# EAGLE design ESP8266-ILI9341-V003_2 (EAGLE 7.5.0)
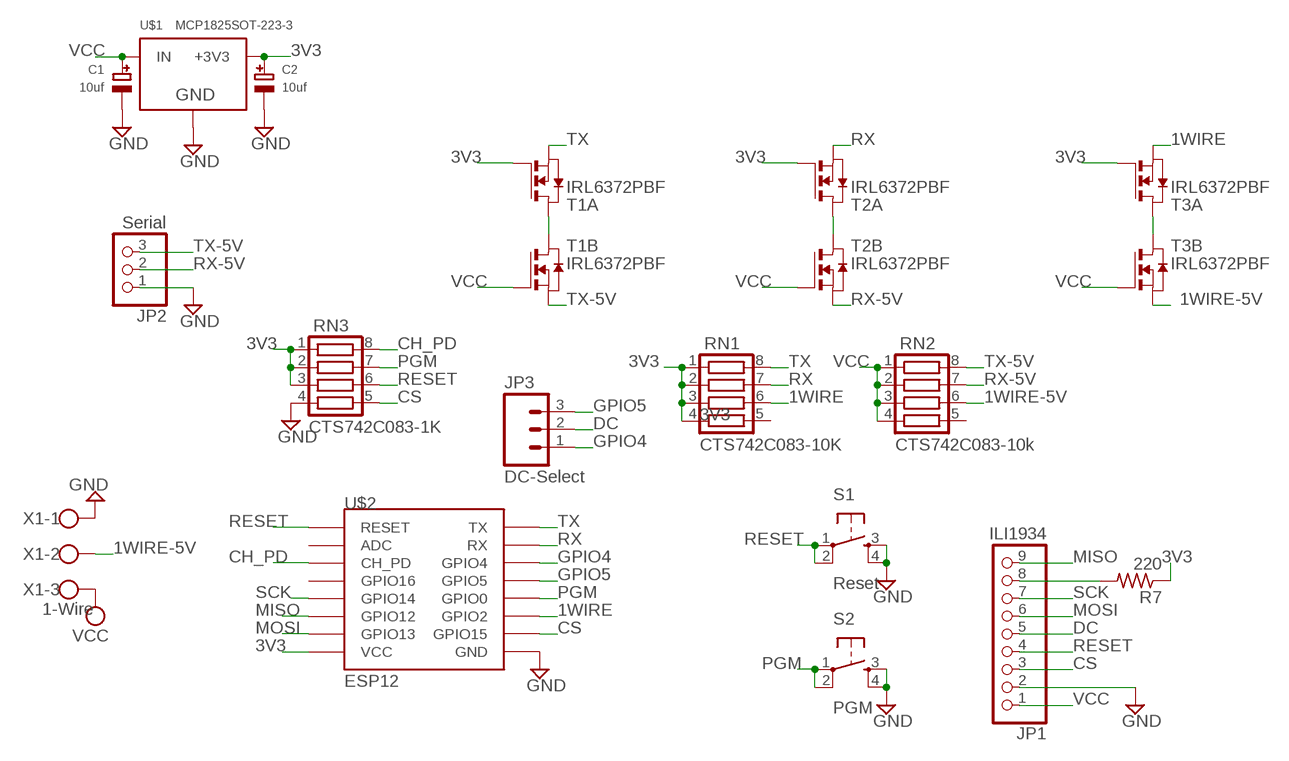
[diagram p0: schematic, sheet 1]

## Parts
C1  10uf  CAP_TANTALUMA/3216_REFLOW  [EIA3216-18/A-R]
C2  10uf  CAP_TANTALUMA/3216_REFLOW  [EIA3216-18/A-R]
JP1  ILI1934  PINHD-1X9  [1X09-BIG]
JP2  Serial  PINHD-1X3  [1X03]
JP3  DC-Select  M03PTH  [1X03]
R7  220  R-US_M1206  [M1206]
RN1  CTS742C083-10K  CTS742C083  [CTS742C083]
RN2  CTS742C083-10k  CTS742C083  [CTS742C083]
RN3  CTS742C083-1K  CTS742C083  [CTS742C083]
S1  Reset  TAC_SWITCHPTH  [TACTILE-PTH]
S2  PGM  TAC_SWITCHPTH  [TACTILE-PTH]
T1  IRL6372PBF  [SO-8-DUAL]
T2  IRL6372PBF  [SO-8-DUAL]
T3  IRL6372PBF  [SO-8-DUAL]
U$1  MCP1825SOT-223-3  [SOT-223]
U$2  ESP12  [ESP12]
X1  1-Wire  W237-103  [W237-103]

## Nets
1WIRE: RN1.6 T3.1(A:S) U$2.GPIO2
1WIRE-5V: RN2.6 T3.3(B:S) X1.2
3V3: C2.+ R7.1 RN1.1 RN1.2 RN1.3 RN1.4 RN3.1 RN3.2 RN3.3 T1.2(A:G) T2.2(A:G) T3.2(A:G) U$1.3(+3V3) U$2.VCC
CH_PD: RN3.8 U$2.CH_PD
CS: JP1.3 RN3.5 U$2.GPIO15
DC: JP1.5 JP3.2
GND: C1.- C2.- JP1.2 JP2.1 RN3.4 S1.3 S1.4 S2.3 S2.4 U$1.2(GND) U$2.GND X1.1
GPIO4: JP3.1 U$2.GPIO4
GPIO5: JP3.3 U$2.GPIO5
MISO: JP1.9 U$2.GPIO12
MOSI: JP1.6 U$2.GPIO13
N$1: T2.5_6(B:D) T2.7_8(A:D)
N$3: T3.5_6(B:D) T3.7_8(A:D)
N$7: T1.5_6(B:D) T1.7_8(A:D)
N$11: JP1.8 R7.2
PGM: RN3.7 S2.1 S2.2 U$2.GPIO0
RESET: JP1.4 RN3.6 S1.1 S1.2 U$2.RESET
RX: RN1.7 T2.1(A:S) U$2.RX
RX-5V: JP2.2 RN2.7 T2.3(B:S)
SCK: JP1.7 U$2.GPIO14
TX: RN1.8 T1.1(A:S) U$2.TX
TX-5V: JP2.3 RN2.8 T1.3(B:S)
VCC: C1.+ JP1.1 RN2.1 RN2.2 RN2.3 RN2.4 T1.4(B:G) T2.4(B:G) T3.4(B:G) U$1.1(IN) X1.3
Unconnected: RN1.5 RN2.5 U$2.ADC U$2.GPIO16

## Library data of the parts
C1 C2 = microbuilder:CAP_TANTALUM: Tantalum Capacitors Wave footprints have larger pads and are meant to be used for hand soldering. Reflow footprints are optimised for solder paste and a reflow oven. EIA3216-18/A-[R/W] - Size A / 3216-18 / 1206 footprint 4.7µF 25V 10% Tantalum Capacitor 10µF 16V 10% Tantalum Capacitor [Digikey: 495-2236-2-ND] EIA3528-21/B-[R/W] - Size B / 3528-21 47µF 10V 10% Tantalum Capactior [Digikey: 495-2216-1-ND] EIA6032-28/C-[R/W] - Size C / 6032-28 10µF 35V 20% Tantalum Capacitor [Digikey: 495-2285-1-ND] 100µF 16V 10% Tantalum Capactior [Digikey: 399-5214-1-ND]
JP1 = Adafruit:PINHD-1X9: Pin header 1x10 0.1" spacing With round pins
JP2 = Adafruit:PINHD-1X3: PIN HEADER
JP3 = SparkFun-Connectors:M03: Header 3 Standard 3-pin 0.1" header. Use with straight break away headers (SKU : PRT-00116), right angle break away headers (PRT-00553), swiss pins (PRT-00743), machine pins (PRT-00117), and female headers (PRT-00115). Molex polarized connector foot print use with SKU : PRT-08232 with associated crimp pins and housings.
R7 = rcl:R-US_: RESISTOR, American symbol
RN1-RN3 = resistor-net:CTS742C083: Chip Resistor Array 4 Single Resistor Source: http://www.ctscorp.com/components/Datasheets/CTSChipArrayDs.pdf; OC_FARNELL: unknown; OC_NEWARK: unknown
S1 S2 = SparkFun-Electromechanical:TAC_SWITCH: Momentary Switch Button commonly used for reset or general input. Spark Fun Electronics SKU : COM-00097 SMT- SWCH-08247
T1-T3 = IRL6372:IRL6372PBF: N-Channel Application-Specific MOSFETs Source: http://www.irf.com/product-info/datasheets/data/irl6372pbf.pdf
U$1 = mcp1825:MCP1825: MCP1825 3.3v LDO Linear Regulator
U$2 = esp8266modules:ESP12: ESP8266 Wifi module 12
X1 = con-wago-500:W237-103: WAGO SCREW CLAMP; MPN: 237-103; OC_FARNELL: unknown; OC_NEWARK: 18M7116

## Net classes
0 default: width 0.254 mm
1 VDD: width 0.508 mm
2 VCC: width 0.508 mm

## Board
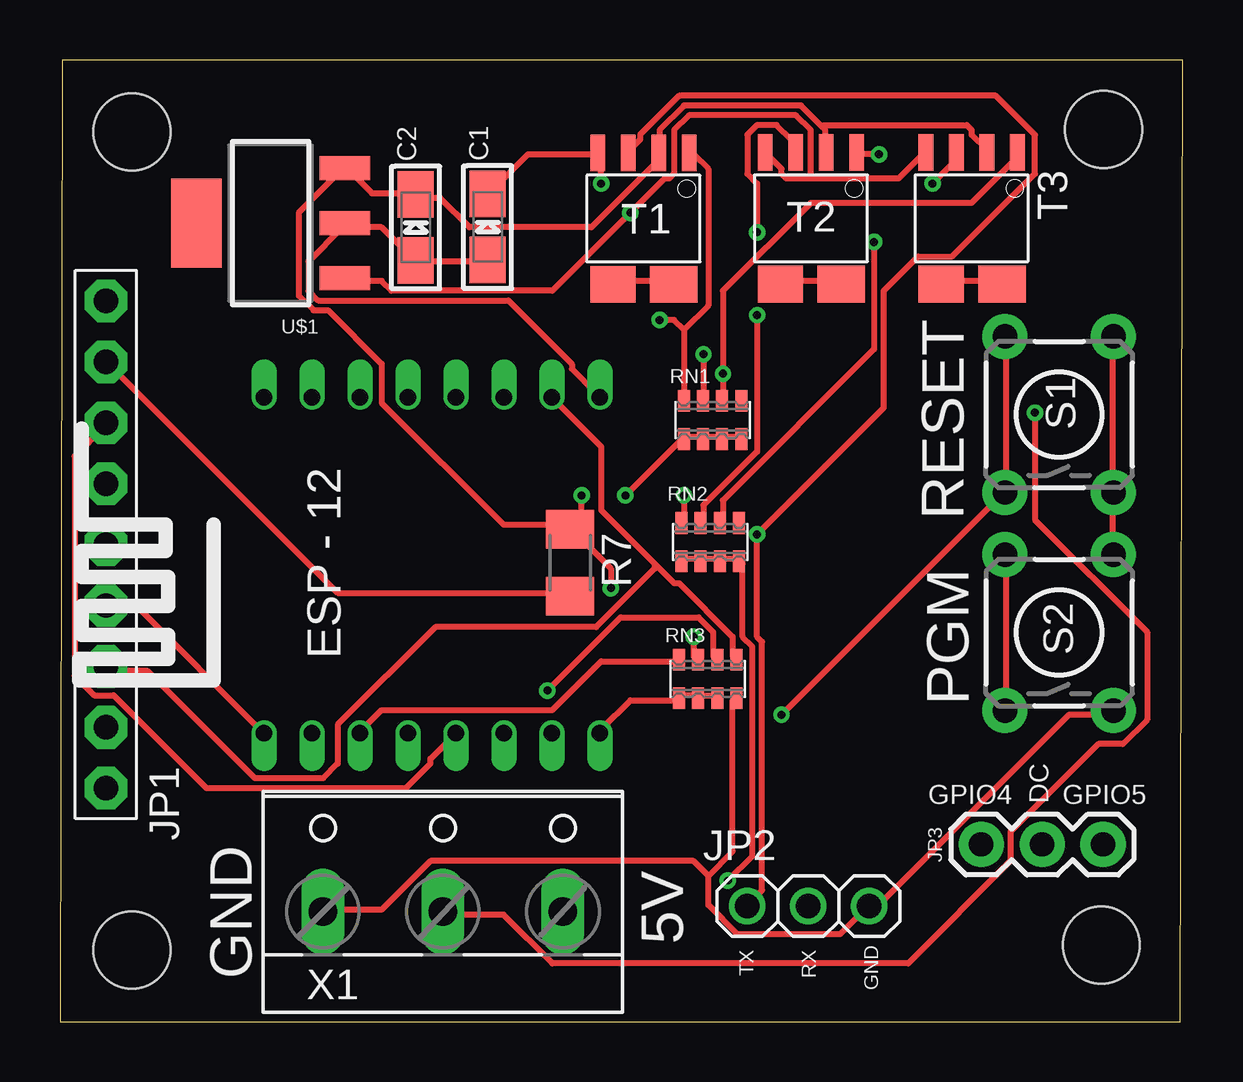
[diagram p1: board, top side]
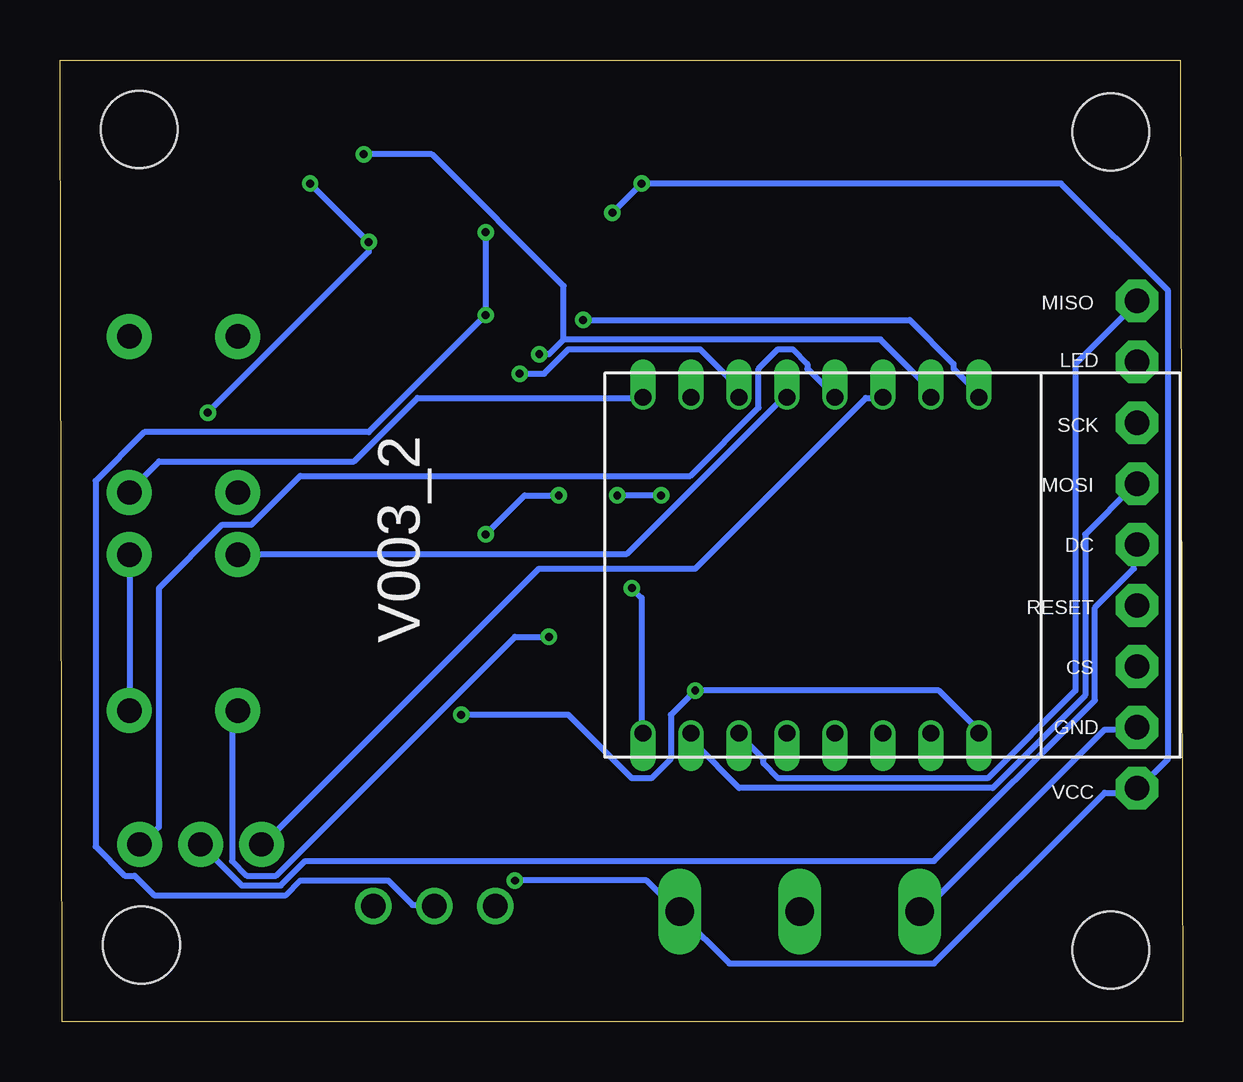
[diagram p2: board, bottom side, seen from below]

Size 46.8 x 40.1 mm. Coordinates in mm from the lower left corner, seen from the top.
Outline: 0,0 46.7,0 46.8,40.1 0.1,40.1 0,0
Copper layers (1*16): Top 0.0356mm / dielectric 1.5011mm / Bottom 0.0356mm
Design rules "OSHPark": minimum track width 6mil, minimum drill 13mil, track to track 6mil, track to pad 6mil, pad to pad 6mil, via to via 6mil, smd to smd 6mil, copper to edge 15mil, drill to drill 6mil, minimum pad ring 7mil, minimum via ring 7mil, stop-mask expansion 3mil, vias tented up to drill 0mil, thermal gap 10mil
Holes 3.2 mm at 3,3 3,37.1 43.5,37.2 43.4,3.2

### Footprints (pad centres in the part's own frame; a part is rotated, then mirrored left to right if it is on the bottom)
EIA3216-18/A-R = smd 1.95 x 1.5: + 1.375,0; - -1.375,0
1X09-BIG = drill 1.016 pad 1.778 octagon: 1 -10.16,0; 2 -7.62,0; 3 -5.08,0; 4 -2.54,0; 5 0,0; 6 2.54,0; 7 5.08,0; 8 7.62,0; 9 10.16,0
1X03 = drill 1.016: 1 -2.54,0; 2 0,0; 3 2.54,0
1X03' = drill 1.016 pad 1.88: 1 0,0; 2 2.54,0; 3 5.08,0
M1206 = smd 1.6 x 2: 1 -1.4,0; 2 1.4,0
CTS742C083 = smd 0.5 x 0.9: 1 -1.2,-0.8; 2 -0.4,-0.8; 3 0.4,-0.8; 4 1.2,-0.8; 5 1.2,0.8; 6 0.4,0.8; 7 -0.4,0.8; 8 -1.2,0.8
TACTILE-PTH = drill 1.016 pad 1.88: 1 -3.251,2.261; 2 3.251,2.261; 3 -3.251,-2.261; 4 3.251,-2.261
SO-8-DUAL = smd 1.524 x 0.61: 1 -2.743,1.905; 2 -2.743,0.635; 3 -2.743,-0.635; 4 -2.743,-1.905 | smd 1.524 x 1.88: 5_6 2.743,-1.27 | smd 1.524 x 1.981: 7_8 2.743,1.27
SOT-223 = smd 1 x 2.1: 1 -2.3,-3.1; 2 0,-3.1; 3 2.3,-3.1 | smd 3.7 x 2.1: 4 0,3.1
ESP12 = drill 0.7 offset: ADC -7.1,3.8; CH_PD -7.1,1.8; GND 6.9,-8.2; GPIO0 6.9,-2.2; GPIO2 6.9,-4.2; GPIO4 6.9,1.8; GPIO5 6.9,-0.2; GPIO12 -7.1,-4.2; GPIO13 -7.1,-6.2; GPIO14 -7.1,-2.2; GPIO15 6.9,-6.2; GPIO16 -7.1,-0.2; RESET -7.1,5.8; RX 6.9,3.8; TX 6.9,5.8; VCC -7.1,-8.2
W237-103 = drill 1.194 long: 1 -5,-1.29; 2 0,-1.29; 3 5,-1.29

### Placement (x,y rotation side)
C1  17.83,33.14 90 top
C2  14.83,33.12 90 top
JP1  1.91,19.9 90 top
JP2  31.19,4.83 180 top
JP3  DC-Select  [1X03']  38.4,7.4 0 top
R7  21.27,19.14 270 top
RN1  27.2,25.1 0 top
RN2  27.1,20 0 top
RN3  27,14.3 0 top
S1  41.65,25.32 90 top
S2  41.65,16.23 90 top
T1  24.32,33.49 270 top
T2  31.3,33.5 270 top
T3  38,33.5 270 top
U$1  8.78,33.3 90 top
U$2  14.3,19.14 90 top
X1  15.96,5.89 0 top

### Tracks (layer width: path | path; a pad name or v marks a point on that pad's centre or on a via)
1WIRE  (via drill 0.33)
  Top 0.254: RN1.6 27.64,26.01 v27.64,27.03 27.64,30.48 31.29,34.14 38,34.14 40.03,36.17 T3.1
  Bottom 0.254: v27.64,27.03 26.62,27.03 25.6,28.04 20.12,28.04 18.69,26.62 18.69,26.21 U$2.GPIO2
1WIRE-5V  (via drill 0.33)
  Top 0.254: v33.93,32.51 33.93,28.04 27.64,21.74 27.64,20.93 RN2.6 | v36.37,34.95 37.19,35.76 37.19,36.17 T3.3 | v40.64,25.4 40.64,20.93 45.31,16.26 45.31,12.6 44.3,11.58 43.28,11.58 39.62,7.92 39.62,6.71 35.36,2.44 20.52,2.44 18.49,4.47 16.05,4.47 X1.2
  Bottom 0.254: v36.37,34.95 v33.93,32.51 33.93,32.11 v40.64,25.4
3V3  (via drill 0.33)
  Top 0.254: RN3.3 27.23,13.61 26.62,13.61 RN3.2 26.42,13.61 25.81,13.61 RN3.1 25.6,13.41 23.77,13.41 22.55,12.19 U$2.VCC | RN1.4 28.25,24.38 27.64,24.38 RN1.3 27.43,24.38 26.82,24.38 RN1.2 26.62,24.38 26.01,24.38 RN1.1 25.81,24.18 v23.57,21.95 | v21.74,21.95 21.74,21.13 21.34,20.73 R7.1 | v22.96,18.09 22.96,18.9 21.34,20.52 R7.1 | 31.7,37.39 31.9,37.19 31.9,36.37 T2.2 | 31.7,37.39 30.89,38.2 26.01,38.2 24.99,37.19 24.99,36.37 T1.2 24.79,36.17 24.79,35.76 22.15,33.12 17.07,33.12 15.85,34.34 14.83,34.34 C2.+ 14.63,34.54 13.01,34.54 11.99,35.56 U$1.3 11.79,35.56 9.96,33.73 9.96,30.28 10.57,29.67 11.18,29.67 13.41,27.43 13.41,25.81 18.49,20.73 21.13,20.73 R7.1 | 31.7,37.39 37.8,37.39 38,37.19 38,36.98 38.61,36.37 T3.2
  Bottom 0.254: v21.74,21.95 v23.57,21.95 | v22.96,18.09 22.55,17.68 22.55,12.19 U$2.VCC
CH_PD
  Top 0.254: RN3.8 25.6,15.04 22.55,15.04 20.52,13.01 13.41,13.01 12.6,12.19 U$2.CH_PD
CS
  Top 0.254: 24.79,19.1 22.55,21.34 22.55,23.98 20.52,26.01 U$2.GPIO15 | 24.79,19.1 25.6,18.29 25.81,18.29 28.04,16.05 28.04,15.24 RN3.5 | 24.79,19.1 24.79,18.9 22.35,16.46 15.65,16.46 11.58,12.39 11.58,10.77 10.97,10.16 8.13,10.16 3.66,14.63 2.03,14.63 JP1.3
DC
  Bottom 0.254: JP1.5 2.03,19.71 2.03,18.9 3.66,17.27 3.66,13.41 10.36,6.71 36.58,6.71 37.59,5.69 39.22,5.69 40.84,7.32 JP3.2
GND
  Top 0.254: C1.- 17.68,31.7 14.83,31.7 C2.- 14.63,31.9 13.41,33.12 11.99,33.12 U$1.2 11.79,33.12 10.36,31.7 10.36,30.48 10.77,30.07 18.69,30.07 21.34,27.43 21.34,27.23 22.35,26.21 U$2.GND | 27.03,6.1 28.04,7.11 28.04,13.41 RN3.4 | 27.03,6.1 27.03,4.88 28.25,3.66 32.51,3.66 33.53,4.67 JP2.1 33.73,4.88 34.14,4.88 42.06,12.8 43.89,12.8 S2.3 | S2.4 43.89,19.51 43.89,21.95 S1.3 43.89,22.15 43.89,28.45 S1.4 | 27.03,6.1 26.42,6.71 15.44,6.71 13.41,4.67 10.97,4.67 X1.1
  Bottom 0.254: JP1.2 2.03,12.19 3.25,12.19 10.77,4.67 X1.1 | S2.3 43.89,13.01 43.89,19.3 S2.4 | U$2.GND 22.55,26.01 31.9,26.01 34.54,23.37 42.67,23.37 43.89,22.15 S1.3
GPIO4
  Bottom 0.254: U$2.GPIO4 12.6,26.01 13.21,26.01 20.32,18.9 26.82,18.9 38.2,7.52 JP3.1
GPIO5
  Bottom 0.254: U$2.GPIO5 14.63,26.21 15.65,27.23 15.65,27.43 16.26,28.04 16.87,28.04 17.68,27.23 17.68,25.6 20.52,22.76 36.78,22.76 38.81,20.73 40.03,20.73 42.67,18.09 42.67,8.13 43.28,7.52 JP3.3
MISO
  Bottom 0.254: U$2.GPIO12 18.49,11.99 17.48,10.97 17.48,10.77 16.87,10.16 8.13,10.16 4.47,13.82 4.47,27.43 2.03,29.87 JP1.9
MOSI
  Bottom 0.254: U$2.GPIO13 20.32,11.99 20.32,11.58 18.49,9.75 7.92,9.75 4.06,13.61 4.06,20.32 2.03,22.35 JP1.6
N$1
  Top 0.254: T2.5_6 30.07,30.89 32.51,30.89 T2.7_8
N$3
  Top 0.254: T3.5_6 36.78,30.89 39.22,30.89 T3.7_8
N$7
  Top 0.254: T1.5_6 23.16,30.89 25.4,30.89 T1.7_8
N$11
  Top 0.254: R7.2 21.13,17.88 11.58,17.88 2.03,27.43 JP1.8
PGM  (via drill 0.33)
  Top 0.254: v26.42,16.05 26.42,15.24 RN3.7 | S2.1 39.42,13.01 39.42,19.3 S2.2
  Bottom 0.254: v26.42,16.05 27.84,16.05 37.8,6.1 39.01,6.1 39.62,6.71 39.62,12.6 39.42,12.8 S2.1 | U$2.GPIO0 16.66,26.01 23.16,19.51 39.22,19.51 S2.2
RESET  (via drill 0.33)
  Top 0.254: S1.2 39.42,28.45 39.42,22.15 S1.1 39.22,21.95 v30.07,12.8 | v20.32,13.82 23.37,16.87 26.62,16.87 27.23,16.26 27.23,15.24 RN3.6 | JP1.4 2.03,17.27 3.25,17.27 8.33,12.19 U$2.RESET
  Bottom 0.254: U$2.RESET 8.53,12.19 10.16,13.82 v20.32,13.82 21.34,12.8 21.34,10.97 22.15,10.16 22.96,10.16 25.6,12.8 v30.07,12.8
RX  (via drill 0.33)
  Top 0.254: v26.82,27.84 26.82,26.01 RN1.7 | v34.14,36.17 33.33,36.17 T2.1
  Bottom 0.254: v26.82,27.84 26.42,27.84 25.81,28.45 | 25.81,28.45 12.6,28.45 10.36,26.21 U$2.RX | v34.14,36.17 31.29,36.17 25.81,30.68 25.81,28.45
RX-5V  (via drill 0.33)
  Top 0.254: v29.06,29.46 29.06,23.77 26.82,21.54 26.82,20.93 RN2.7 | v29.06,32.92 29.06,34.95 28.65,35.36 28.65,36.98 29.06,37.39 29.87,37.39 30.48,36.78 30.48,36.37 T2.3
  Bottom 0.254: v29.06,32.92 v29.06,29.46 33.93,24.59 43.28,24.59 45.31,22.55 45.31,7.32 44.09,6.1 43.69,6.1 42.88,5.28 37.39,5.28 36.78,5.89 33.12,5.89 32.11,4.88 31.29,4.88 JP2.2
SCK
  Top 0.254: U$2.GPIO14 16.46,11.99 15.44,10.97 15.44,10.77 14.43,9.75 6.1,9.75 2.23,13.61 1.42,13.61 0.61,14.43 0.61,23.57 1.83,24.79 JP1.7
TX  (via drill 0.33)
  Top 0.254: 26.01,28.85 26.01,26.01 RN1.8 | 26.01,28.85 27.03,29.87 27.03,35.56 26.42,36.17 T1.1 | v24.99,29.26 25.6,29.26 26.01,28.85
  Bottom 0.254: v24.99,29.26 11.38,29.26 9.55,27.43 9.55,27.23 8.53,26.21 U$2.TX
TX-5V  (via drill 0.33)
  Top 0.254: v26.01,21.95 26.01,20.93 RN2.8 | JP2.3 28.65,4.88 29.26,5.49 29.26,15.85 29.06,16.05 v29.06,20.32 34.34,25.6 34.34,30.48 35.76,31.9 37.19,31.9 40.64,35.36 40.64,36.98 39.01,38.61 25.81,38.61 24.18,36.98 24.18,36.78 23.77,36.37 T1.3
  Bottom 0.254: v26.01,21.95 27.43,21.95 v29.06,20.32
VCC  (via drill 0.33)
  Top 0.254: C1.+ 17.88,34.54 19.51,36.17 22.35,36.17 T1.4 22.55,36.17 v22.55,34.95 | 31.29,35.15 34.95,35.15 35.97,36.17 T3.4 | 31.29,35.15 30.28,35.15 30.07,35.36 30.07,35.56 29.46,36.17 T2.4 | 31.29,35.15 31.29,37.19 30.68,37.8 26.21,37.8 25.6,37.19 25.6,35.36 25.4,35.15 25.2,35.15 v23.77,33.73 20.52,30.48 13.82,30.48 13.41,30.89 11.99,30.89 U$1.1 | RN2.1 26.01,19.3 26.62,19.3 RN2.2 26.82,19.3 27.43,19.3 RN2.3 27.64,19.3 28.25,19.3 RN2.4 28.45,19.1 28.45,16.05 28.85,15.65 28.85,6.91 v27.84,5.89
  Bottom 0.254: v23.77,33.73 v22.55,34.95 5.08,34.95 0.61,30.48 0.61,10.97 1.83,9.75 JP1.1 2.03,9.55 3.25,9.55 10.36,2.44 18.9,2.44 20.93,4.47 X1.3 21.13,4.67 22.35,5.89 v27.84,5.89

### Text on the board
tNames: RESET | PGM | GPIO4 | GPIO5 | DC | 5V | TX | RX | GND | GND
bNames: MISO | LED | SCK | MOSI | DC | RESET | V003_2 | CS | GND | VCC